# Altium schematic sheet RoomBug.SCHDOC
size A4
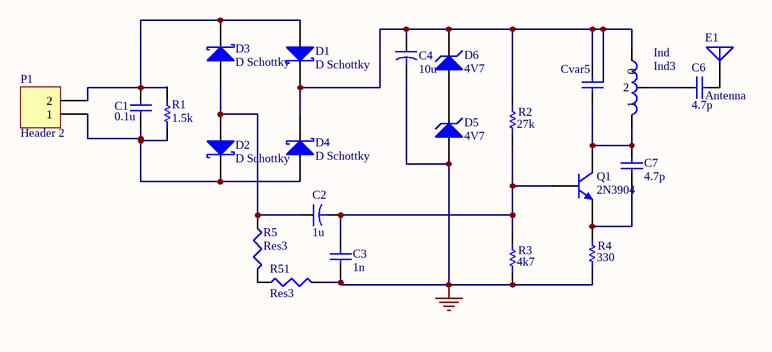
[diagram p0: RoomBug.SCHDOC]

## Parts
C1  0.1u  [RAD-0.3]
C2  1u  [CAPR5-4X5]
C3  1n  [RAD-0.3]
C4  10u  [CAPR5-4X5]
C6  4.7p  [RAD-0.3]
C7  4.7p  [RAD-0.3]
Cvar5  2-20p  [CapVarAmarillo]  (value not drawn)
D1  D Schottky  [DSO-C2/X2.3]
D2  D Schottky  [DSO-C2/X2.3]
D3  D Schottky  [DSO-C2/X2.3]
D4  D Schottky  [DSO-C2/X2.3]
D5  4V7  [DIODE-0.7]
D6  4V7  [DIODE-0.7]
E1  Antenna  [PIN1]
Ind  Ind3  [Ind 7mm]
P1  Header 2  [HDR1X2]
Q1  2N3904  [TO-92A]
R1  1.5k  [AXIAL-0.3]
R2  27k  [AXIAL-0.3]
R3  4k7  [AXIAL-0.3]
R4  330  [AXIAL-0.3]
R5  Res3  [CR1608-0603]
R51  Res3  [CR1608-0603]

## Nets
GND: C3.1 C4.2 D5.1(A) R3.1 R4.1 R51.2
NetC1_1: C1.1 D2.2(K) D4.1(A) P1.1 R1.1
NetC1_2: C1.2 D1.1(A) D3.2(K) P1.2 R1.2
NetC2_1: C2.1 D2.1(A) D3.1(A) R5.1
NetC2_2: C2.2 C3.2 Q1.2(B) R2.1 R3.2
NetC4_1: C4.1 Cvar5.2 Cvar5.3 D1.2(K) D4.2(K) D6.2(K) Ind.0 R2.2
NetC6_1: C6.1 E1.1(A)
NetC6_2: C6.2 Ind.2
NetC7_1: C7.1 Q1.1(E) R4.2
NetC7_2: C7.2 Cvar5.1 Ind.1 Q1.3(C)
NetD5_2: D5.2(K) D6.1(A)
NetR5_2: R5.2 R51.1

## Library data of the parts
C1 C3 C6 C7 = Cap: Capacitor; Published: 8-Jun-2000; LatestRevisionDate: 17-Jul-2002; LatestRevisionNote: Re-released for DXP Platform.; Publisher: Altium Limited
C2 C4 = Cap2: Capacitor; Published: 23-Sep-2002; Publisher: Altium Limited
Cvar5 = CapVar1
D1-D4 = D Schottky: Schottky Diode; Published: 8-Jun-2000; LatestRevisionDate: 17-Jul-2002; LatestRevisionNote: Re-released for DXP Platform.; PackageReference: SMB; Publisher: Altium Limited; Code_JEDEC: DO-214-AA
D5 D6 = D Zener: Zener Diode; Published: 8-Jun-2000; LatestRevisionDate: 17-Jul-2002; LatestRevisionNote: Re-released for DXP Platform.; Publisher: Altium Limited
E1 = Antenna: Generic Antenna; Published: 24-Mar-1999; LatestRevisionDate: 17-Jul-2002; LatestRevisionNote: Re-released for DXP Platform.; Publisher: Altium Limited
P1 = Header 2: Header, 2-Pin; LatestRevisionDate: 17-Jul-2002; LatestRevisionNote: Re-released for DXP Platform.; Publisher: Altium Limited
Q1 = 2N3904: NPN General Purpose Amplifier; pin to pad: 1>2 2>3 3>1; Published: 8-Jun-2000; LatestRevisionDate: 17-Jan-2003; LatestRevisionNote: PCB Footprint 'BCY-W3/D4.7' replaced; DatasheetDocument: 1997; PackageDocument: Sep-1998; PackageReference: TO-92A; Publisher: Altium Limited; ComponentLink1Description: Manufacturer Link; ComponentLink1URL: http://www.fairchildsemi.com/
R1-R4 = Res1: Resistor; Published: 8-Jun-2000; LatestRevisionDate: 17-Jul-2002; LatestRevisionNote: Re-released for DXP Platform.; Publisher: Altium Limited
R5 R51 = Res3: Resistor; Published: 8-Jun-2000; LatestRevisionDate: 4-Mar-2005; LatestRevisionNote: PCB Footprint replaced.; Publisher: Altium Limited